# EAGLE design led3 (EAGLE 9.6.2)
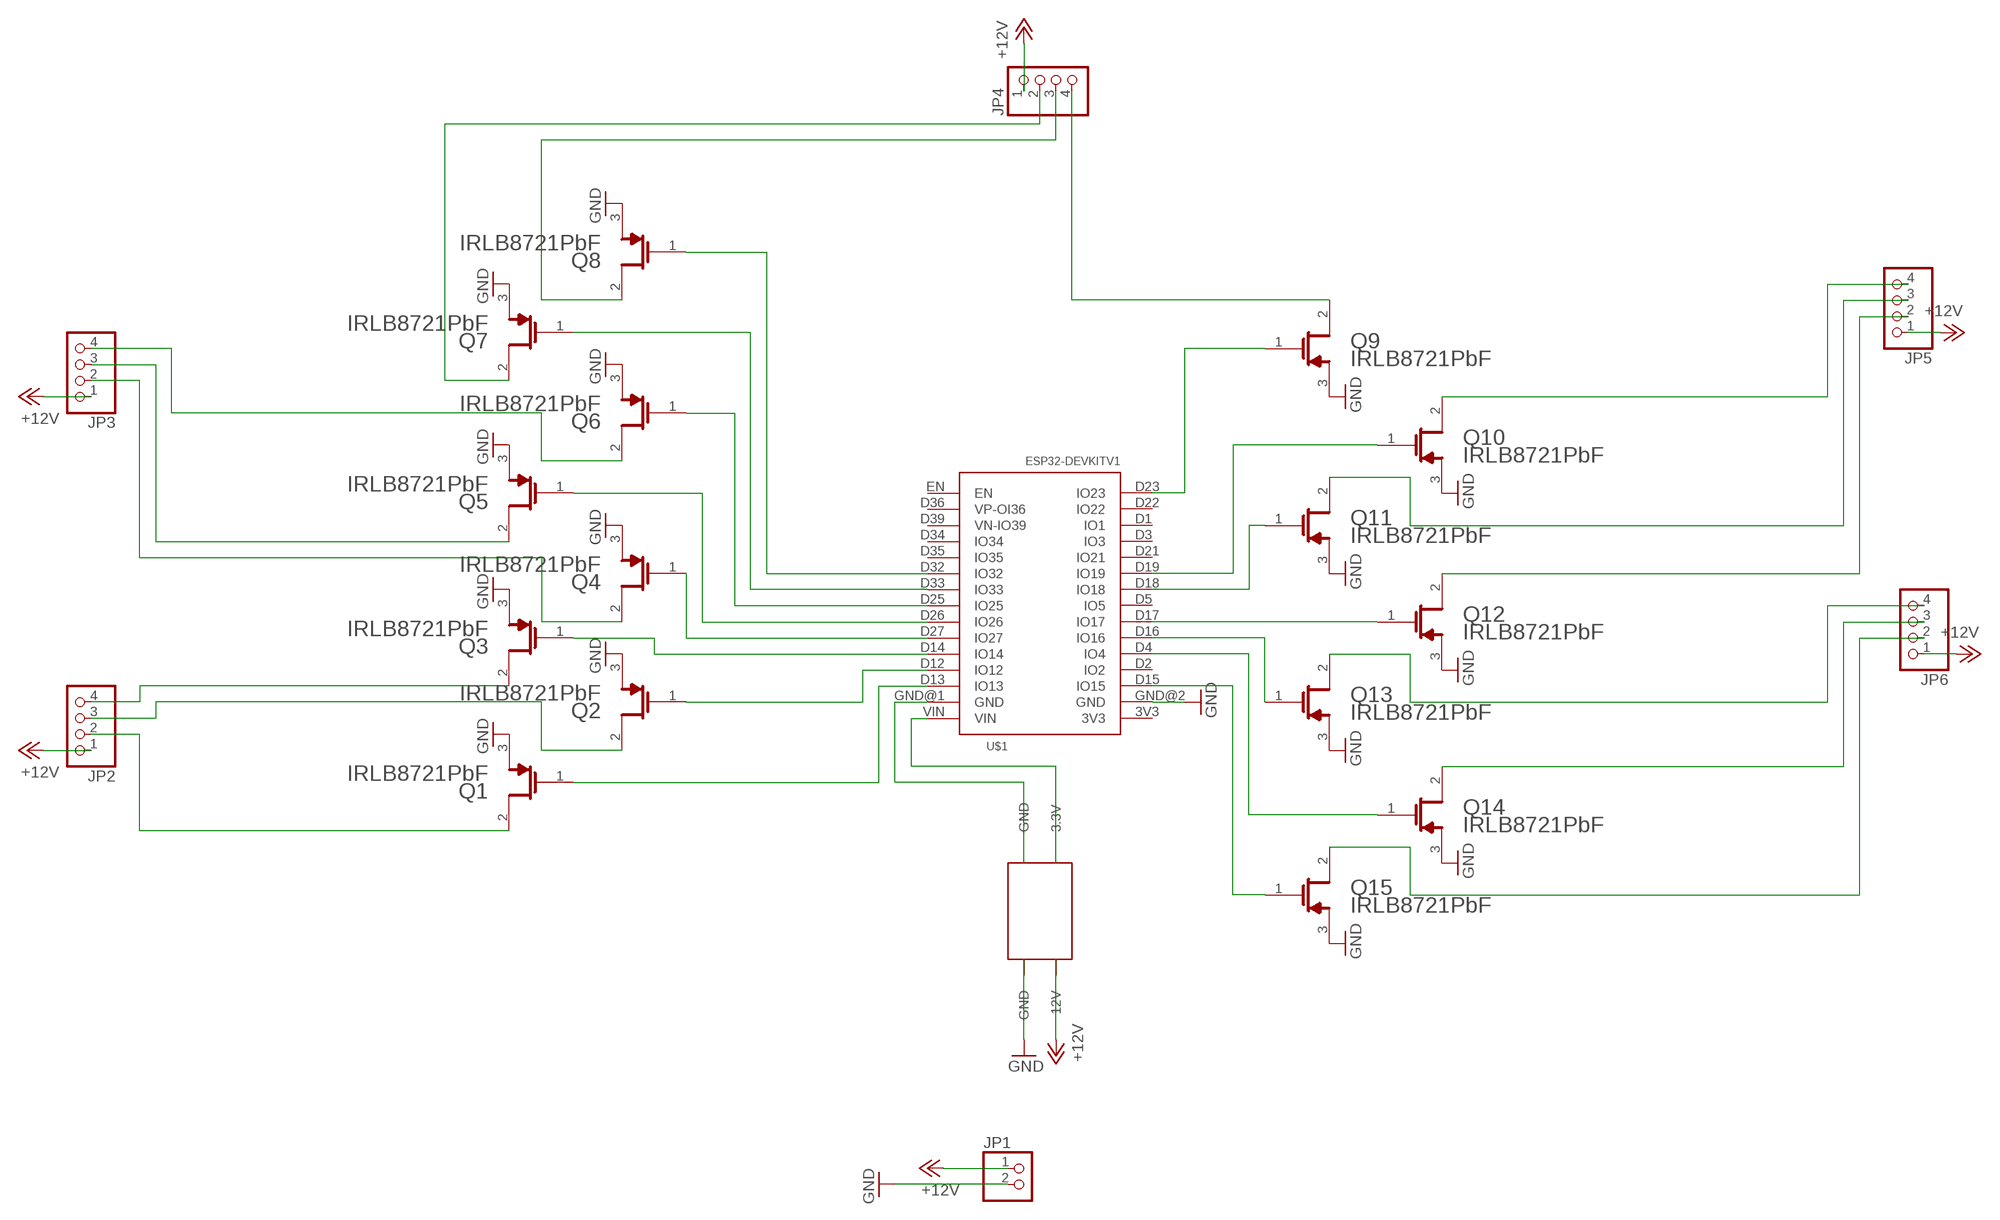
[diagram p0: schematic, sheet 1]

## Parts
JP1  PINHD-1X2  [1X02]
JP2  PINHD-1X4  [1X04]
JP3  PINHD-1X4  [1X04]
JP4  PINHD-1X4  [1X04]
JP5  PINHD-1X4  [1X04]
JP6  PINHD-1X4  [1X04]
Q1  INFINEON_IRLB8721PBFINFINEON_IRLB8721PBF_0_0  [INFINEON_IRLB8721PBF_0]
Q2  INFINEON_IRLB8721PBFINFINEON_IRLB8721PBF_0_0  [INFINEON_IRLB8721PBF_0]
Q3  INFINEON_IRLB8721PBFINFINEON_IRLB8721PBF_0_0  [INFINEON_IRLB8721PBF_0]
Q4  INFINEON_IRLB8721PBFINFINEON_IRLB8721PBF_0_0  [INFINEON_IRLB8721PBF_0]
Q5  INFINEON_IRLB8721PBFINFINEON_IRLB8721PBF_0_0  [INFINEON_IRLB8721PBF_0]
Q6  INFINEON_IRLB8721PBFINFINEON_IRLB8721PBF_0_0  [INFINEON_IRLB8721PBF_0]
Q7  INFINEON_IRLB8721PBFINFINEON_IRLB8721PBF_0_0  [INFINEON_IRLB8721PBF_0]
Q8  INFINEON_IRLB8721PBFINFINEON_IRLB8721PBF_0_0  [INFINEON_IRLB8721PBF_0]
Q9  INFINEON_IRLB8721PBFINFINEON_IRLB8721PBF_0_0  [INFINEON_IRLB8721PBF_0]
Q10  INFINEON_IRLB8721PBFINFINEON_IRLB8721PBF_0_0  [INFINEON_IRLB8721PBF_0]
Q11  INFINEON_IRLB8721PBFINFINEON_IRLB8721PBF_0_0  [INFINEON_IRLB8721PBF_0]
Q12  INFINEON_IRLB8721PBFINFINEON_IRLB8721PBF_0_0  [INFINEON_IRLB8721PBF_0]
Q13  INFINEON_IRLB8721PBFINFINEON_IRLB8721PBF_0_0  [INFINEON_IRLB8721PBF_0]
Q14  INFINEON_IRLB8721PBFINFINEON_IRLB8721PBF_0_0  [INFINEON_IRLB8721PBF_0]
Q15  INFINEON_IRLB8721PBFINFINEON_IRLB8721PBF_0_0  [INFINEON_IRLB8721PBF_0]
U$1  ESP32DEVKITV1  [ESP32-DEVKITV1]
U$2  MP2307-MINI-360  [MP2307-MINI-360]

## Nets
+12V [All]: JP1.1 JP2.1 JP3.1 JP4.1 JP5.1 JP6.1 U$2.12VP(12V)
GND [All]: JP1.2 Q1.3(S) Q2.3(S) Q3.3(S) Q4.3(S) Q5.3(S) Q6.3(S) Q7.3(S) Q8.3(S) Q9.3(S) Q10.3(S) Q11.3(S) Q12.3(S) Q13.3(S) Q14.3(S) Q15.3(S) U$1.GND@2(GND) U$2.GND@1P(GND)
N$1 [All]: U$1.VIN U$2.3.3VP(3.3V)
N$2 [All]: Q1.1(G) U$1.D13(IO13)
N$3 [All]: Q2.1(G) U$1.D12(IO12)
N$4 [All]: Q3.1(G) U$1.D14(IO14)
N$5 [All]: JP3.3 Q5.2(D)
N$6 [All]: JP3.2 Q4.2(D)
N$7 [All]: Q6.1(G) U$1.D25(IO25)
N$8 [All]: Q7.1(G) U$1.D33(IO33)
N$9 [All]: Q8.1(G) U$1.D32(IO32)
N$10 [All]: Q9.1(G) U$1.D23(IO23)
N$11 [All]: Q15.1(G) U$1.D15(IO15)
N$12 [All]: Q14.1(G) U$1.D4(IO4)
N$13 [All]: Q13.1(G) U$1.D16(IO16)
N$14 [All]: Q12.1(G) U$1.D17(IO17)
N$15 [All]: Q11.1(G) U$1.D18(IO18)
N$16 [All]: Q10.1(G) U$1.D19(IO19)
N$17 [All]: JP2.2 Q1.2(D)
N$18 [All]: JP2.3 Q2.2(D)
N$19 [All]: JP2.4 Q3.2(D)
N$20 [All]: Q4.1(G) U$1.D27(IO27)
N$21 [All]: Q5.1(G) U$1.D26(IO26)
N$22 [All]: JP3.4 Q6.2(D)
N$23 [All]: JP4.2 Q7.2(D)
N$24 [All]: JP4.3 Q8.2(D)
N$25 [All]: JP4.4 Q9.2(D)
N$26 [All]: JP6.2 Q15.2(D)
N$27 [All]: JP6.3 Q14.2(D)
N$28 [All]: JP6.4 Q13.2(D)
N$29 [All]: JP5.2 Q12.2(D)
N$30 [All]: JP5.3 Q11.2(D)
N$31 [All]: JP5.4 Q10.2(D)
N$32 [All]: U$1.GND@1(GND) U$2.GND@2P(GND)
Unconnected: U$1.3V3 U$1.D1(IO1) U$1.D2(IO2) U$1.D3(IO3) U$1.D5(IO5) U$1.D21(IO21) U$1.D22(IO22) U$1.D34(IO34) U$1.D35(IO35) U$1.D36(VP-OI36) U$1.D39(VN-IO39) U$1.EN

## Library data of the parts
JP1 = pinhead:PINHD-1X2: PIN HEADER
JP2-JP6 = pinhead:PINHD-1X4: PIN HEADER
Q1-Q15 = Infineon - IRLB8721PbF:INFINEON_IRLB8721PBF: High Frequency Synchronous Buck Converter; CENTROID_NOT_SPECIFIED: No; DATASHEET: https://upverter.com/datasheet/6023de1dc29e00ae136963535d37ebb95ee78d8c.pdf; DIGIKEY_DESCRIPTION: TRANS MOSFET N-CH 30V 62A TO-220AB; DIGIKEY_PART_NUMBER: IRLB8721PBF-ND; IMPORTED_FROM: octopart; IPC_LAND_PATTERN_NAME: TO-220; LEAD_FREE: yes; MF: Infineon; MOUNTING_TYPE: through hole; MOUSER_PART_NUMBER: 942-IRLB8721PBF; MPN: IRLB8721PbF; NUM_PINS: 3; PACKAGE: TO220AB-3; PREFIX: Q; ROHS: yes; SYMBOL_0_0: N-Channel Enhanced MOSFET; TEMPERATURE_RANGE_HIGH: +175°C; TEMPERATURE_RANGE_LOW: -55°C; TYPE: transistor
U$1 = ESP32:ESP32DEVKITV1
U$2 = MP2307-MINI-360:MP2307-MINI-360

## Net classes
1 All: width 1.5 mm, clearance 0.5 mm

## Board
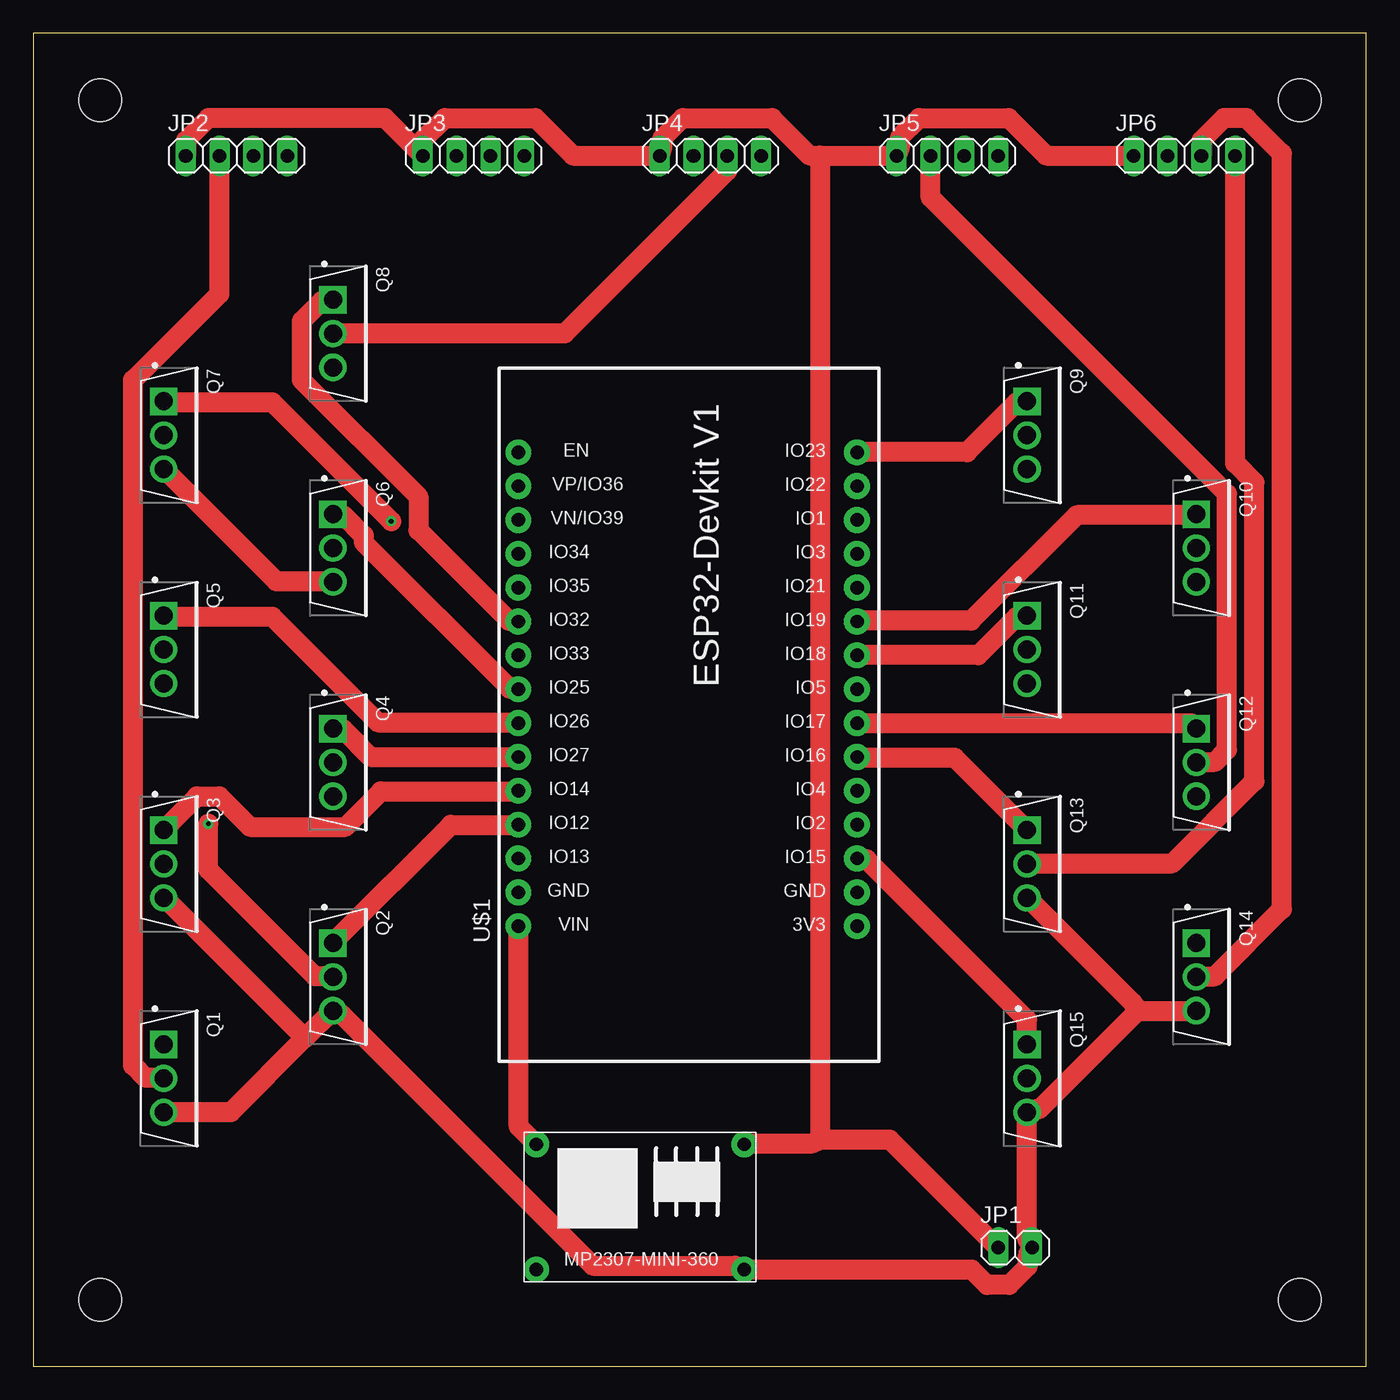
[diagram p1: board, top side]
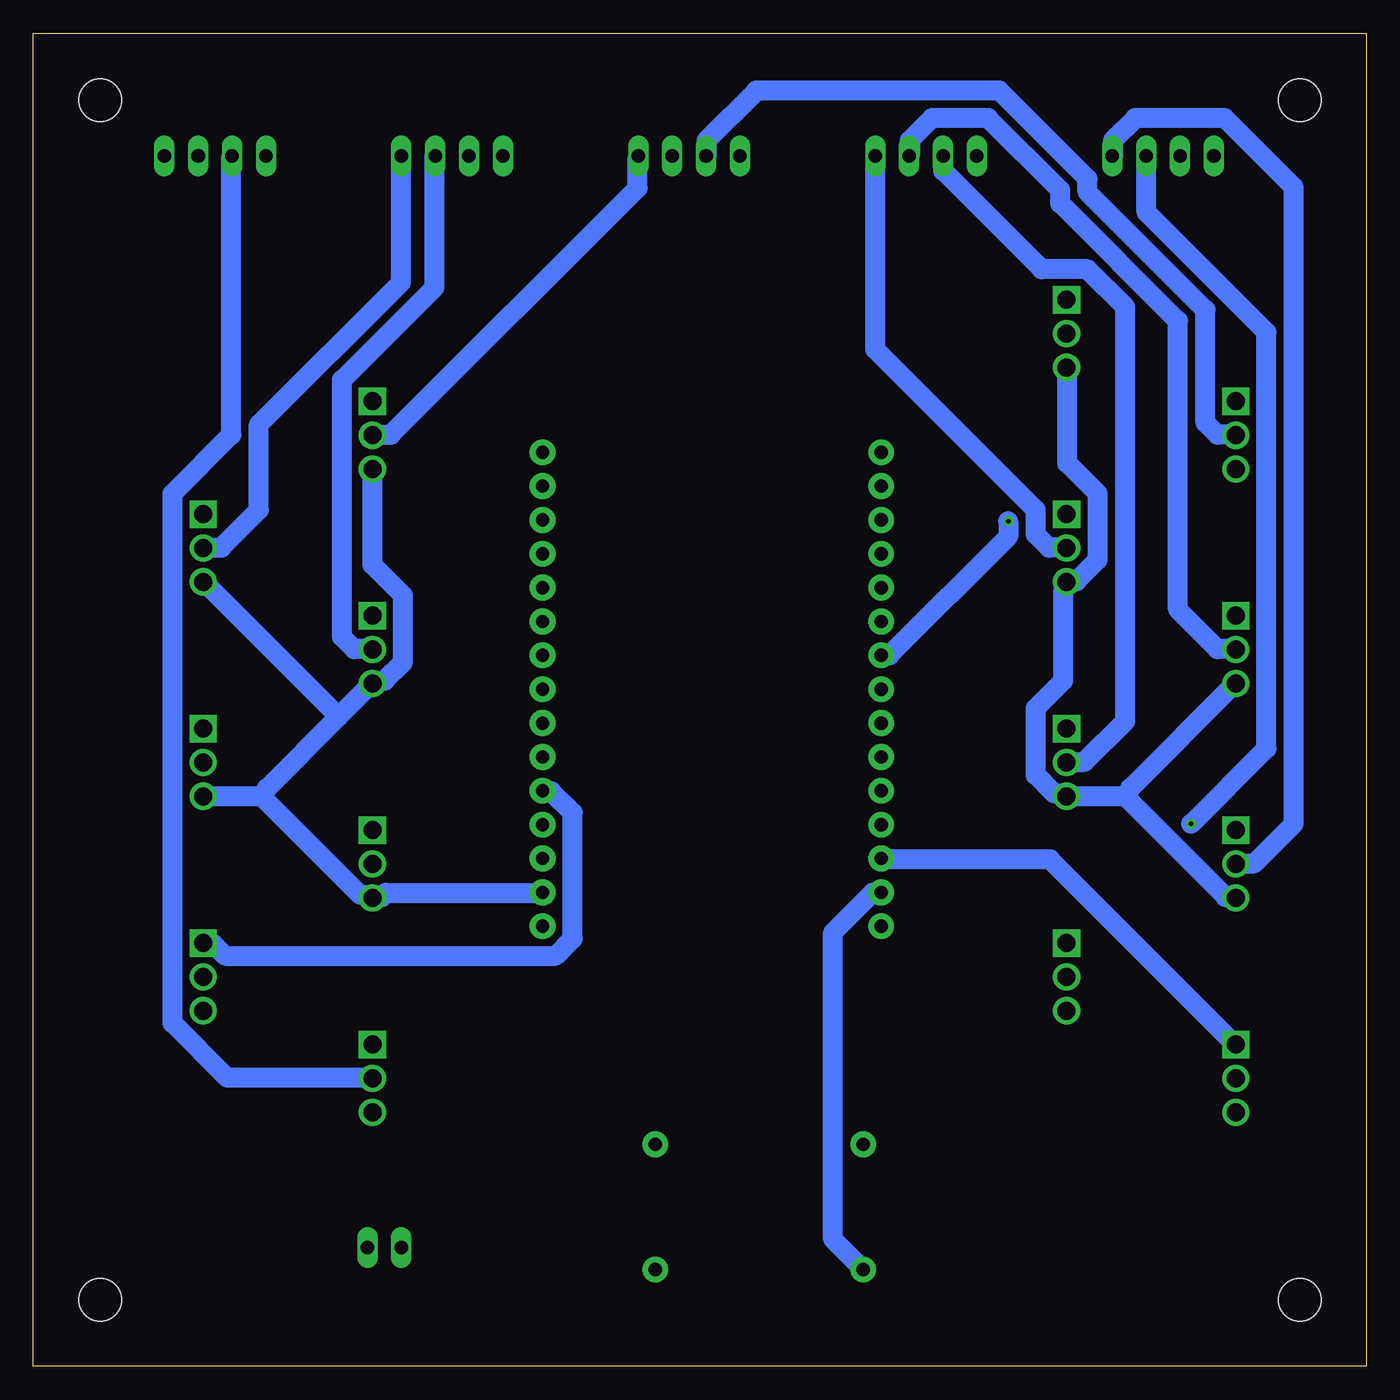
[diagram p2: board, bottom side, seen from below]

Size 100 x 100 mm. Coordinates in mm from the lower left corner, seen from the top.
Outline: 0,0 100,0 100,100 0,100 0,0
Copper layers (1*16): Top 0.035mm / dielectric 0.15mm / Bottom 0.035mm
Design rules "default": minimum track width 6mil, minimum drill 0.35mm, track to track 6mil, track to pad 6mil, pad to pad 6mil, via to via 6mil, smd to smd 6mil, copper to edge 40mil, drill to drill 6mil, minimum pad ring 10mil, minimum via ring 8mil, stop-mask expansion 4mil, vias tented up to drill 0mil, thermal gap 10mil
Holes 3.2 mm at 5,5 95,5 5,95 95,95

### Footprints (pad centres in the part's own frame; a part is rotated, then mirrored left to right if it is on the bottom)
1X02 = drill 1.016 long: 1 -1.27,0; 2 1.27,0
1X04 = drill 1.016 long: 1 -3.81,0; 2 -1.27,0; 3 1.27,0; 4 3.81,0
INFINEON_IRLB8721PBF_0 = drill 1.35 pad 2.05 square: 1 -0.378,2.54 | drill 1.35 pad 2.05: 2 -0.378,0; 3 -0.378,-2.54
ESP32-DEVKITV1 = drill 1 pad 1.93: 3V3 -16.52,-12.27; D1 13.96,-12.27; D2 -8.9,-12.27; D3 11.42,-12.27; D4 -6.36,-12.27; D5 1.26,-12.27; D12 -8.9,13.135; D13 -11.44,13.135; D14 -6.36,13.135; D15 -11.44,-12.27; D16 -3.82,-12.27; D17 -1.28,-12.27; D18 3.8,-12.27; D19 6.34,-12.27; D21 8.88,-12.27; D22 16.5,-12.27; D23 19.04,-12.27; D25 1.26,13.135; D26 -1.28,13.135; D27 -3.82,13.135; D32 6.34,13.135; D33 3.8,13.135; D34 11.42,13.135; D35 8.88,13.135; D36 16.5,13.135; D39 13.96,13.135; EN 19.04,13.135; GND@1 -13.98,13.135; GND@2 -13.98,-12.27; VIN -16.52,13.135
MP2307-MINI-360 = drill 1 pad 1.93: 3.3VP 0.9,10.3; 12VP 16.5,10.3; GND@1P 16.5,0.9; GND@2P 0.9,0.9

### Placement (x,y rotation side)
JP1  73.66,8.89 0 top
JP2  15.24,90.81 0 top
JP3  33.02,90.81 0 top
JP4  50.8,90.81 0 top
JP5  68.58,90.81 0 top
JP6  86.36,90.81 0 top
Q1  10.16,21.59 0 top
Q2  22.86,29.21 0 top
Q3  10.16,37.68 0 top
Q4  22.86,45.3 0 top
Q5  10.16,53.76 0 top
Q6  22.86,61.38 0 top
Q7  10.16,69.85 0 top
Q8  22.86,77.47 0 top
Q9  74.93,69.85 0 top
Q10  87.63,61.38 0 top
Q11  74.93,53.76 0 top
Q12  87.63,45.3 0 top
Q13  74.93,37.68 0 top
Q14  87.63,29.21 0 top
Q15  74.93,21.59 0 top
U$1  49.53,49.53 90 top
U$2  36.83,6.35 0 top

### Tracks (layer width: path | path; a pad name or v marks a point on that pad's centre or on a via)
+12V
  Top 1.5: 59,16.99 64.26,16.99 72.34,8.91 JP1.1 | JP2.1 11.46,90.83 11.46,91.97 13.13,93.65 26.39,93.65 29.21,90.83 JP3.1 29.13,91.9 30.89,93.65 37.67,93.65 40.49,90.83 46.97,90.83 JP4.1 47.19,91.52 47.19,92.13 48.72,93.65 55.42,93.65 58.24,90.83 59,90.83 | 59,90.83 64.72,90.83 JP5.1 65.02,91.52 65.02,92.2 66.47,93.65 73.18,93.65 76,90.83 82.55,90.83 JP6.1 | 59,90.83 59,16.99 | U$2.12VP 53.34,16.69 58.37,16.69 59,16.99
GND
  Top 1.5: Q6.3 22.43,58.9 18.24,58.9 9.86,67.28 Q7.3 | Q1.3 14.81,19.05 20.37,24.61 | 20.37,24.61 22.43,26.67 Q2.3 23.16,26.36 41.99,7.54 52.65,7.54 U$2.GND@1P 70.41,7.24 71.55,6.1 73.23,6.1 74.6,7.47 74.6,8.23 JP1.2 74.55,9.53 Q15.3 75.23,19.28 75.46,19.28 82.86,26.67 | 20.37,24.61 9.86,35.13 Q3.3 | 82.86,26.67 Q14.3 | 82.86,26.67 82.47,27.28 74.62,35.13 Q13.3
  Bottom 1.5: Q8.3 22.43,74.91 22.43,67.74 20.14,65.46 20.14,60.5 21.74,58.9 22.43,58.9 Q6.3 22.73,58.14 22.73,51.44 24.79,49.38 24.79,44.35 23.42,42.98 23.19,42.98 Q4.3 22.43,42.75 18.09,42.75 | 18.09,42.75 10.54,35.2 9.86,35.2 Q3.3 | Q5.3 9.86,51.21 17.7,43.36 18.09,42.75 | U$1.GND@2 61.82,35.51 73.56,35.51 73.86,35.2 74.55,35.2 Q13.3 75.23,35.36 75.46,35.36 82.86,42.75 | 82.86,42.75 87.2,42.75 Q12.3 | 77.1,48.73 82.47,43.36 82.86,42.75 | 77.1,48.73 74.62,51.21 Q11.3 73.86,51.44 73.64,51.44 72.26,52.81 72.26,57.84 74.55,60.12 74.55,67.28 Q9.3 | 77.1,48.73 87.2,58.83 Q10.3
N$1
  Top 1.5: U$1.VIN 36.42,32.99 36.42,17.98 37.72,16.69 U$2.3.3VP
N$2
  Bottom 1.5: U$1.D13 36.37,38.02 23.72,38.02 9.86,24.16 Q1.1
N$3
  Top 1.5: U$1.D12 36.37,40.62 31.34,40.62 22.5,31.77 Q2.1
N$4
  Top 1.5: U$1.D14 36.37,43.13 26.09,43.13 23.42,40.46 16.26,40.46 13.97,42.75 12.29,42.75 9.78,40.23 Q3.1
N$5
  Bottom 1.5: JP3.3 34.24,90.83 34.24,91.97 32.56,93.65 28.37,93.65 22.96,88.24 22.96,87.25 14.12,78.41 14.12,56.77 11.15,53.8 9.86,53.8 Q5.2
N$6
  Bottom 1.5: JP3.2 31.73,90.75 31.73,89.69 24.33,82.3 20.9,82.3 18.09,79.48 18.09,48.39 21.13,45.34 22.43,45.34 Q4.2
N$7
  Top 1.5: U$1.D25 36.37,50.83 35.76,50.83 24.79,61.8 24.79,62.33 23.27,63.86 22.5,63.86 Q6.1
N$8  (via drill 0.35)
  Top 1.5: v26.85,63.4 17.93,72.31 9.86,72.31 Q7.1
  Bottom 1.5: v26.85,63.4 26.85,62.26 35.76,53.34 36.37,53.34 U$1.D33
N$9
  Top 1.5: U$1.D32 36.37,55.93 35.69,55.93 28.91,62.71 28.91,65.23 20.14,73.99 20.14,78.41 21.67,79.93 22.43,79.93 Q8.1
N$10
  Top 1.5: U$1.D23 61.82,68.58 70.05,68.58 73.79,72.31 74.55,72.31 Q9.1
N$11
  Top 1.5: U$1.D15 61.82,38.02 62.51,38.02 74.55,25.98 74.55,24.16 Q15.1
N$12
  Bottom 1.5: U$1.D4 61.75,43.13 61.14,43.13 59.54,41.53 59.54,32.08 60.83,30.79 85.6,30.79 86.51,31.7 87.2,31.7 Q14.1
N$13
  Top 1.5: U$1.D16 61.82,45.64 69.14,45.64 74.55,40.23 Q13.1
N$14
  Top 1.5: U$1.D17 61.82,48.23 86.82,48.23 87.2,47.85 Q12.1
N$15
  Top 1.5: U$1.D18 61.82,53.34 70.89,53.34 73.79,56.24 74.55,56.24 Q11.1
N$16
  Top 1.5: U$1.D19 61.82,55.93 70.36,55.93 78.28,63.86 87.2,63.86 Q10.1
N$17
  Top 1.5: JP2.2 13.97,80.47 7.49,73.99 7.49,22.55 8.41,21.64 9.78,21.64 Q1.2
N$18  (via drill 0.35)
  Top 1.5: v13.13,40.69 13.13,37.26 21.13,29.26 22.43,29.26 Q2.2
  Bottom 1.5: v13.13,40.69 7.49,46.33 7.49,77.57 16.48,86.56 16.48,90.75 JP2.3
N$19
  Bottom 1.5: JP2.4 19,90.83 19,91.97 17.32,93.65 10.62,93.65 5.44,88.47 5.44,40.69 8.41,37.72 9.78,37.72 Q3.2
N$20
  Top 1.5: U$1.D27 36.37,45.72 25.32,45.72 23.27,47.78 22.5,47.78 Q4.1
N$21
  Top 1.5: U$1.D26 36.37,48.31 25.86,48.31 17.93,56.24 9.86,56.24 Q5.1
N$22
  Bottom 1.5: JP3.4 36.83,76.28 24.79,64.24 24.79,62.41 23.8,61.42 22.5,61.42 Q6.2
N$23
  Bottom 1.5: JP4.2 49.48,90.83 49.48,91.97 45.74,95.71 27.53,95.71 20.9,89.08 20.9,88.09 12.06,79.25 12.06,70.79 11.15,69.88 9.86,69.88 Q7.2
N$24
  Top 1.5: JP4.3 52.07,89.69 39.88,77.5 22.5,77.5 Q8.2
N$25
  Bottom 1.5: JP4.4 54.66,90.75 54.66,88.39 73.18,69.88 74.55,69.88 Q9.2
N$26
  Bottom 1.5: JP6.2 85.14,90.75 85.14,69.88 89.56,65.46 89.56,25.76 85.45,21.64 74.62,21.64 Q15.2
N$27
  Top 1.5: JP6.3 87.66,90.83 87.66,91.97 89.33,93.65 91.01,93.65 93.67,90.98 93.67,34.29 88.65,29.26 87.27,29.26 Q14.2
N$28
  Top 1.5: JP6.4 90.17,67.74 91.62,66.29 91.62,43.89 85.45,37.72 74.62,37.72 Q13.2
N$29
  Top 1.5: JP5.2 67.31,87.71 89.56,65.46 89.56,46.25 88.65,45.34 87.27,45.34 Q12.2
N$30
  Bottom 1.5: JP5.3 69.9,90.75 69.9,80.92 76.83,73.99 76.83,54.71 75.92,53.8 74.62,53.8 Q11.2
N$31
  Bottom 1.5: JP5.4 72.42,90.75 72.42,81.31 83.08,70.64 83.08,64.24 85.9,61.42 87.2,61.42 Q10.2
N$32
  Bottom 1.5: U$2.GND@2P 40.01,9.53 40.01,32.54 37.03,35.51 36.42,35.51 U$1.GND@1